# EAGLE design WAK-Pipe-v11 (EAGLE 6.2)
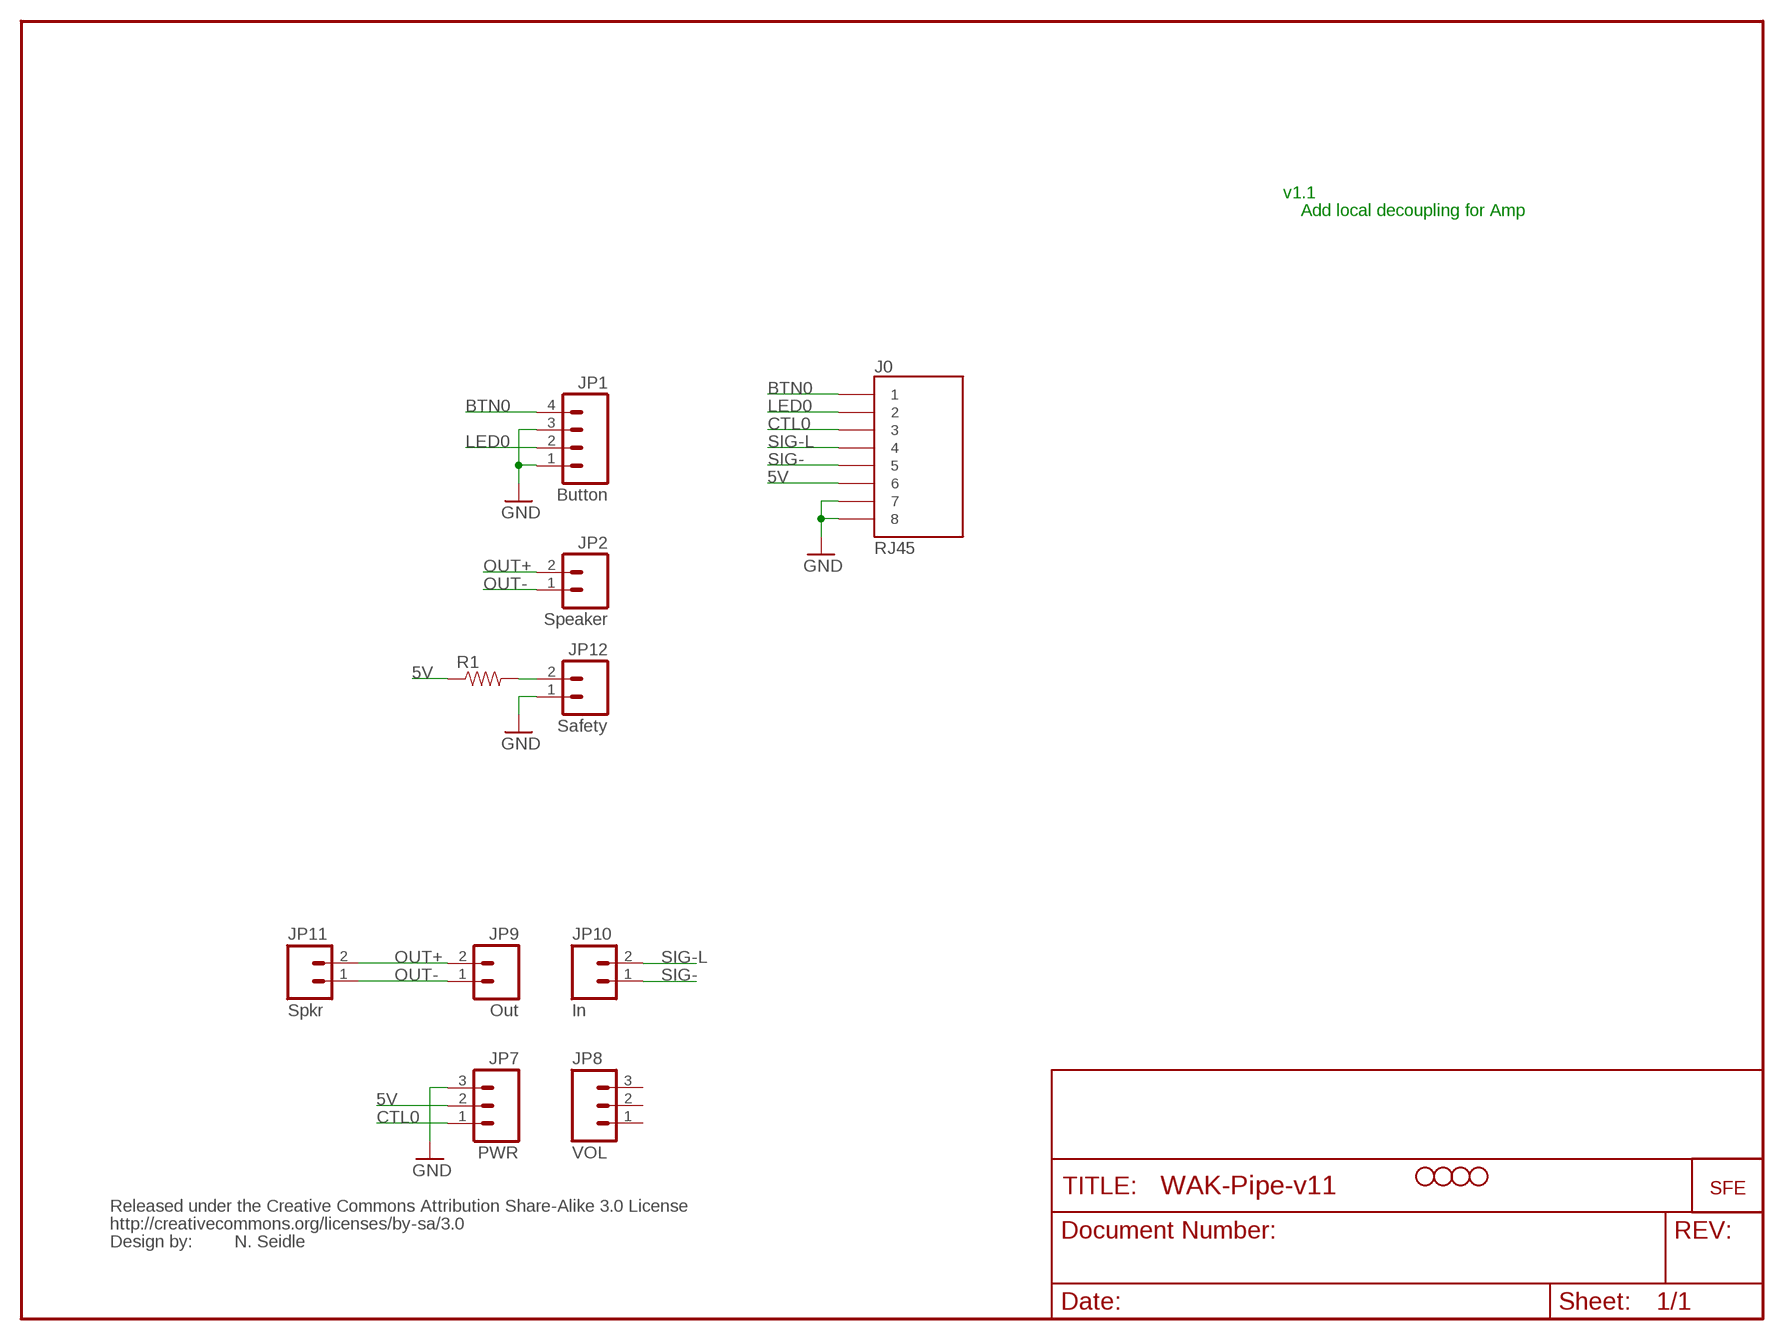
[diagram p0: schematic, sheet 1]

## Parts
J0  RJ45  RJ45-8PTH  [RJ45-8]
JP1  Button  M04JST-PTH  [JST-4-PTH]
JP2  Speaker  M02JST-PTH-2  [JST-2-PTH]
JP3  STAND-OFF  [STAND-OFF]
JP4  STAND-OFF  [STAND-OFF]
JP5  STAND-OFF  [STAND-OFF]
JP6  STAND-OFF  [STAND-OFF]
JP7  PWR  M03PTH  [1X03]
JP8  VOL  M03PTH  [1X03]
JP9  Out  M02PTH  [1X02]
JP10  In  M02PTH  [1X02]
JP11  Spkr  M02PTH  [1X02]
JP12  Safety  M02JST-PTH-2  [JST-2-PTH]
R1  RESISTORAXIAL-0.3  [AXIAL-0.3]
U$1  LOGO-SFENEW  [SFE-NEW-WEBLOGO]
U$2  CREATIVE_COMMONS  [CREATIVE_COMMONS]

## Nets
5V: J0.6 JP7.2 R1.P$1
BTN0: J0.1 JP1.4
CTL0: J0.3 JP7.1
GND: J0.7 J0.8 JP1.1 JP1.3 JP7.3 JP12.1
LED0: J0.2 JP1.2
N$1: JP12.2 R1.P$2
OUT+: JP2.2 JP9.2 JP11.2
OUT-: JP2.1 JP9.1 JP11.1
SIG-: J0.5 JP10.1
SIG-L: J0.4 JP10.2
Unconnected: JP8.1 JP8.2 JP8.3

## Notes on the sheet
- v1.1
- Add local decoupling for Amp
- N. Seidle

## Library data of the parts
J0 = SparkFun-Connectors:RJ45-8: RJ45 Jack Simple RJ45, 8-pin connection - connector for common Cat5, Cat5e, and Cat6 Ethernet cables. Footprint not yet proven in production. Connector sku is PRT-00643; Breakout PCB sku is BOB-00716.
JP1 = SparkFun-Connectors:M04: Header 4 Standard 4-pin 0.1" header. Use with straight break away headers (SKU : PRT-00116), right angle break away headers (PRT-00553), swiss pins (PRT-00743), machine pins (PRT-00117), and female headers (PRT-00115). Molex polarized connector foot print use with SKU : PRT-08231 with associated crimp pins and housings. 1MM SMD Version SKU: PRT-10208
JP2 JP9-JP12 = SparkFun-Connectors:M02: Header 2 Standard 2-pin 0.1" header. Use with straight break away headers (SKU : PRT-00116), right angle break away headers (PRT-00553), swiss pins (PRT-00743), machine pins (PRT-00117), and female headers (PRT-00115). Molex polarized connector foot print use with SKU : PRT-08233 with associated crimp pins and housings.
JP3-JP6 = SparkFun-Electromechanical:STAND-OFF: #4 Stand Off This is the mechanical footprint for a #4 phillips button head screw. Use the keepout ring to avoid running the screw head into surrounding components. SKU : PRT-00447
JP7 JP8 = SparkFun-Connectors:M03: Header 3 Standard 3-pin 0.1" header. Use with straight break away headers (SKU : PRT-00116), right angle break away headers (PRT-00553), swiss pins (PRT-00743), machine pins (PRT-00117), and female headers (PRT-00115). Molex polarized connector foot print use with SKU : PRT-08232 with associated crimp pins and housings.
R1 = SparkFun-Passives:RESISTOR: Resistor Basic schematic elements and footprints for 0603, 1206, and PTH resistors.
U$1 = SparkFun:LOGO-SFE: Spark Fun Electronics PCB Logo This is the standard Spark Fun Electronics PCB logo.
U$2 = SparkFun:CREATIVE_COMMONS

## Board
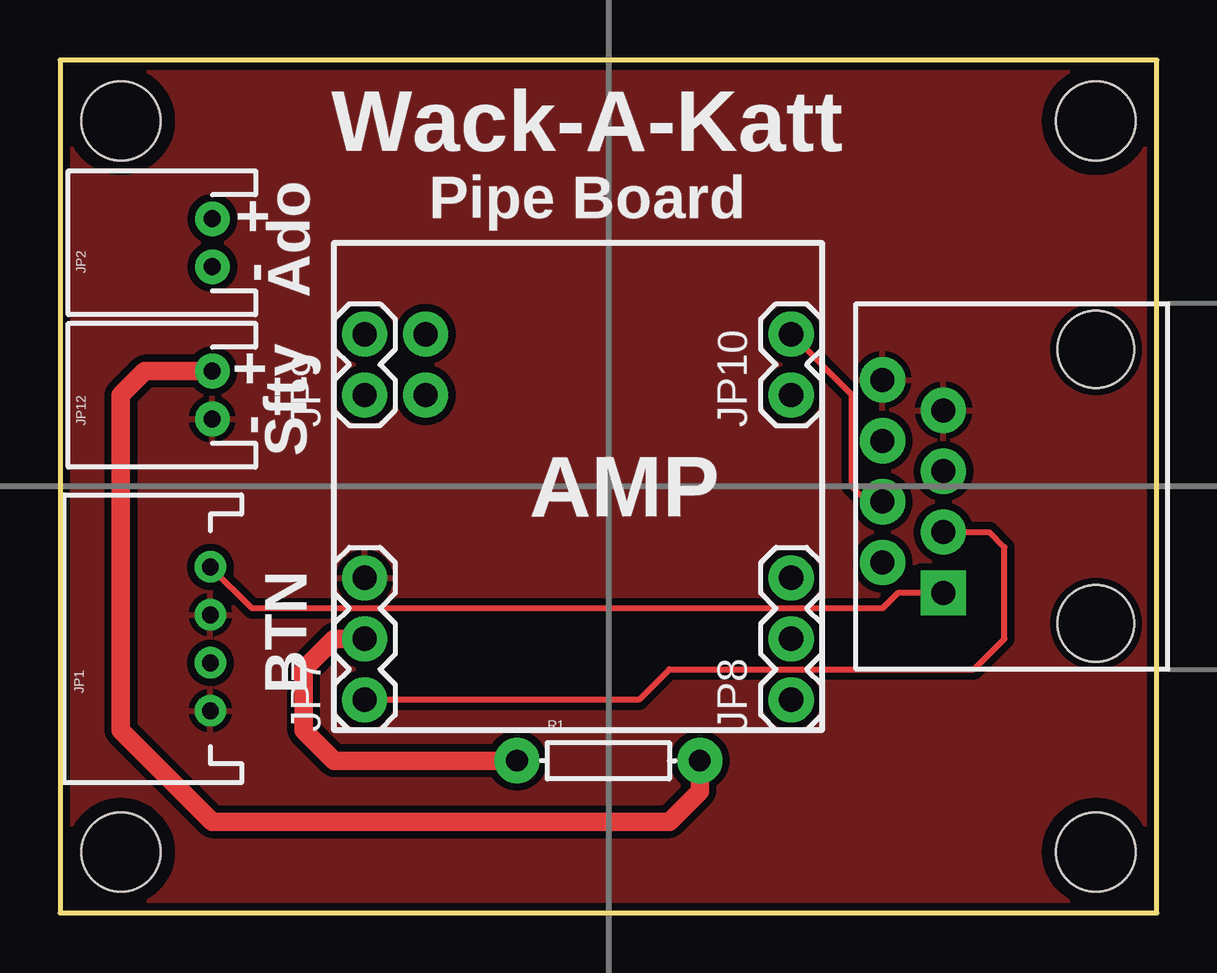
[diagram p1: board, top side]
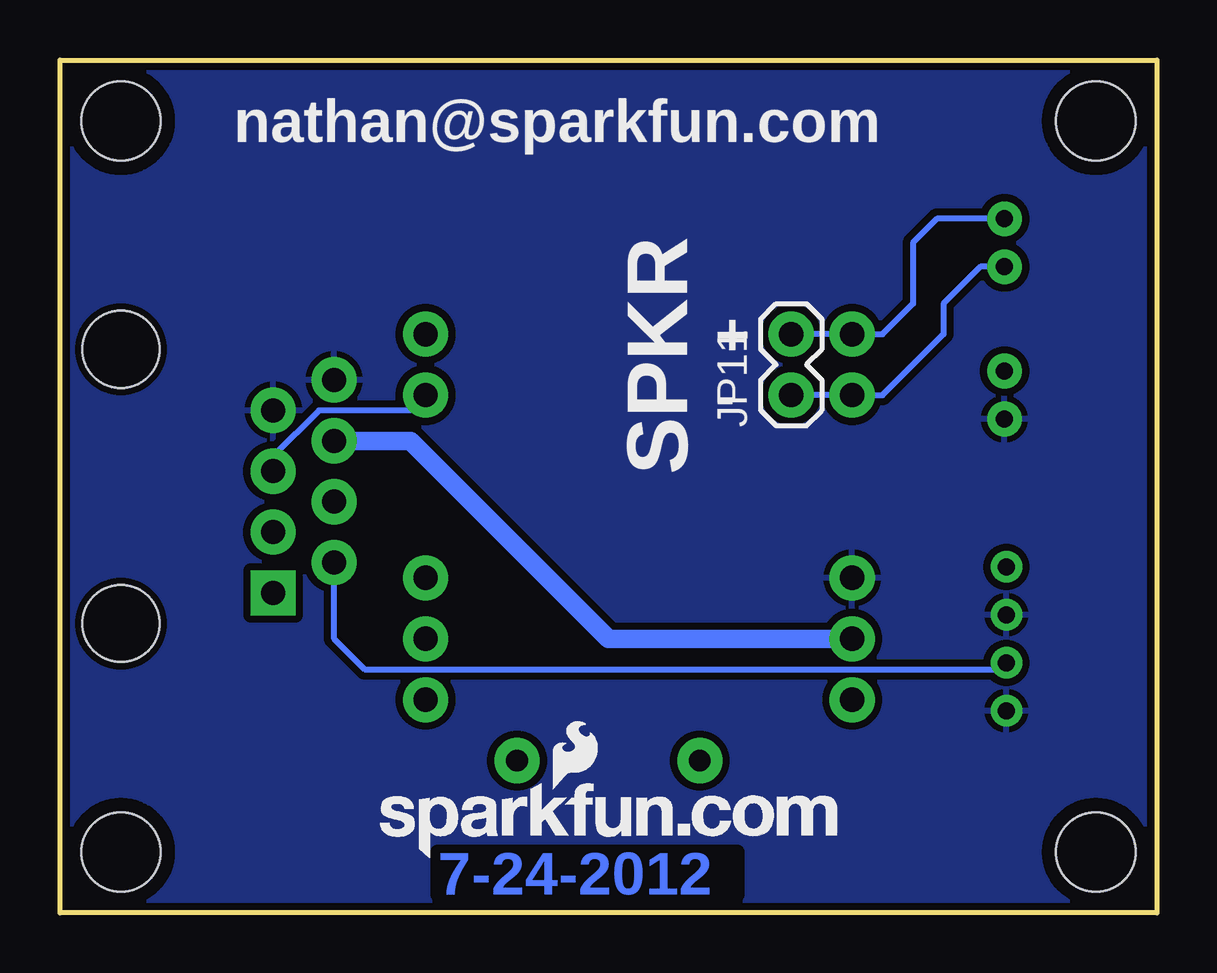
[diagram p2: board, bottom side, seen from below]

Size 45.72 x 35.56 mm. Coordinates in mm from the lower left corner, seen from the top.
Outline: 0,0 45.72,0 45.72,35.56 0,35.56 0,0
Copper layers (1*16): Top 0.035mm / dielectric 1.5mm / Bottom 0.035mm
Design rules: minimum track width 8mil, minimum drill 20mil, track to track 8mil, track to pad 8mil, pad to pad 8mil, via to via 8mil, smd to smd 8mil, copper to edge 10mil, drill to drill 8mil, minimum pad ring 12mil, minimum via ring 10mil, stop-mask expansion 4mil, vias tented up to drill 25mil, thermal gap 10mil

### Footprints (pad centres in the part's own frame; a part is rotated, then mirrored left to right if it is on the bottom)
RJ45-8 = drill 1 pad 1.88 square: 1 -4.445,6.35 | drill 1 pad 1.88: 2 -3.175,8.89; 3 -1.905,6.35; 4 -0.635,8.89; 5 0.635,6.35; 6 1.905,8.89; 7 3.175,6.35; 8 4.445,8.89 | hole 3.2: -5.715,0; 5.715,0
JST-4-PTH = drill 0.7: 1 -3,-5; 2 -1,-5; 3 1,-5; 4 3,-5
JST-2-PTH = drill 0.7 pad 1.448: 1 -1,0; 2 1,0
STAND-OFF = hole 3.302: 0,0
1X03 = drill 1.016 pad 1.88: 1 0,0; 2 2.54,0; 3 5.08,0
1X02 = drill 1.016 pad 1.88: 1 0,0; 2 2.54,0
AXIAL-0.3 = drill 0.9 pad 1.88: P$1 -3.81,0; P$2 3.81,0

### Placement (x,y rotation side)
J0  43.18,17.78 90 top
JP1  1.27,11.43 90 top
JP2  6.35,27.94 90 top
JP3  2.54,33.02 0 top
JP4  43.18,33.02 0 top
JP5  2.54,2.54 0 top
JP6  43.18,2.54 0 top
JP7  12.7,8.89 90 top
JP8  30.48,8.89 90 top
JP9  12.7,21.59 90 top
JP10  30.48,21.59 90 top
JP11  15.24,21.59 90 bottom
JP12  6.35,21.59 90 top
R1  22.86,6.35 0 top
U$1  32.38,2.29 0 bottom
U$2  13.97,-24.13 0 top  (outside the outline)

### Tracks (layer width: path | path; a pad name or v marks a point on that pad's centre or on a via)
5V
  Top 0.762: R1.P$1 11.43,6.35 10.16,7.62 10.16,10.16 11.43,11.43 JP7.2
  Bottom 0.762: J0.6 31.11,19.68 22.86,11.43 JP7.2
BTN0
  Top 0.254: J0.1 34.92,13.34 34.29,12.7 8,12.7 JP1.4
CTL0
  Top 0.254: JP7.1 24.13,8.89 25.4,10.16 38.1,10.16 39.37,11.43 39.37,15.24 38.73,15.88 J0.3
GND
  pour Bottom (isolate 0.305): 0,0 45.72,0 45.72,35.56 0,35.56
  pour Top (isolate 0.305): 0,0 45.72,0 45.72,35.56 0,35.56
LED0
  Bottom 0.254: JP1.2 6.54,10.16 33.02,10.16 34.29,11.43 J0.2
N$1
  Top 0.762: JP12.2 3.54,22.59 2.54,21.59 2.54,7.62 6.35,3.81 25.4,3.81 26.67,5.08 R1.P$2
OUT+
  Bottom 0.254: JP11.2 JP9.2 11.43,24.13 10.16,25.4 10.16,27.94 9.16,28.94 JP2.2
OUT-
  Bottom 0.254: JP11.1 JP9.1 11.43,21.59 8.89,24.13 8.89,25.4 7.35,26.94 JP2.1
SIG-
  Bottom 0.254: JP10.1 31.11,20.95 34.92,20.95 36.83,19.05 J0.5
SIG-L
  Top 0.254: J0.4 33.66,17.14 33.02,17.78 33.02,21.59 JP10.2

### Text on the board
Bottom: 7-24-2012
tPlace: Wack-A-Katt | Pipe Board | + | - | Ado | + | - | Sfty | AMP | BTN
bPlace: nathan@sparkfun.com | + | - | SPKR
tDocu: BTN | Yel | Black | COM | LED-Round | Red | LED-Flat | Blue